# Altium schematic sheet MotorVSense.SchDoc
size A
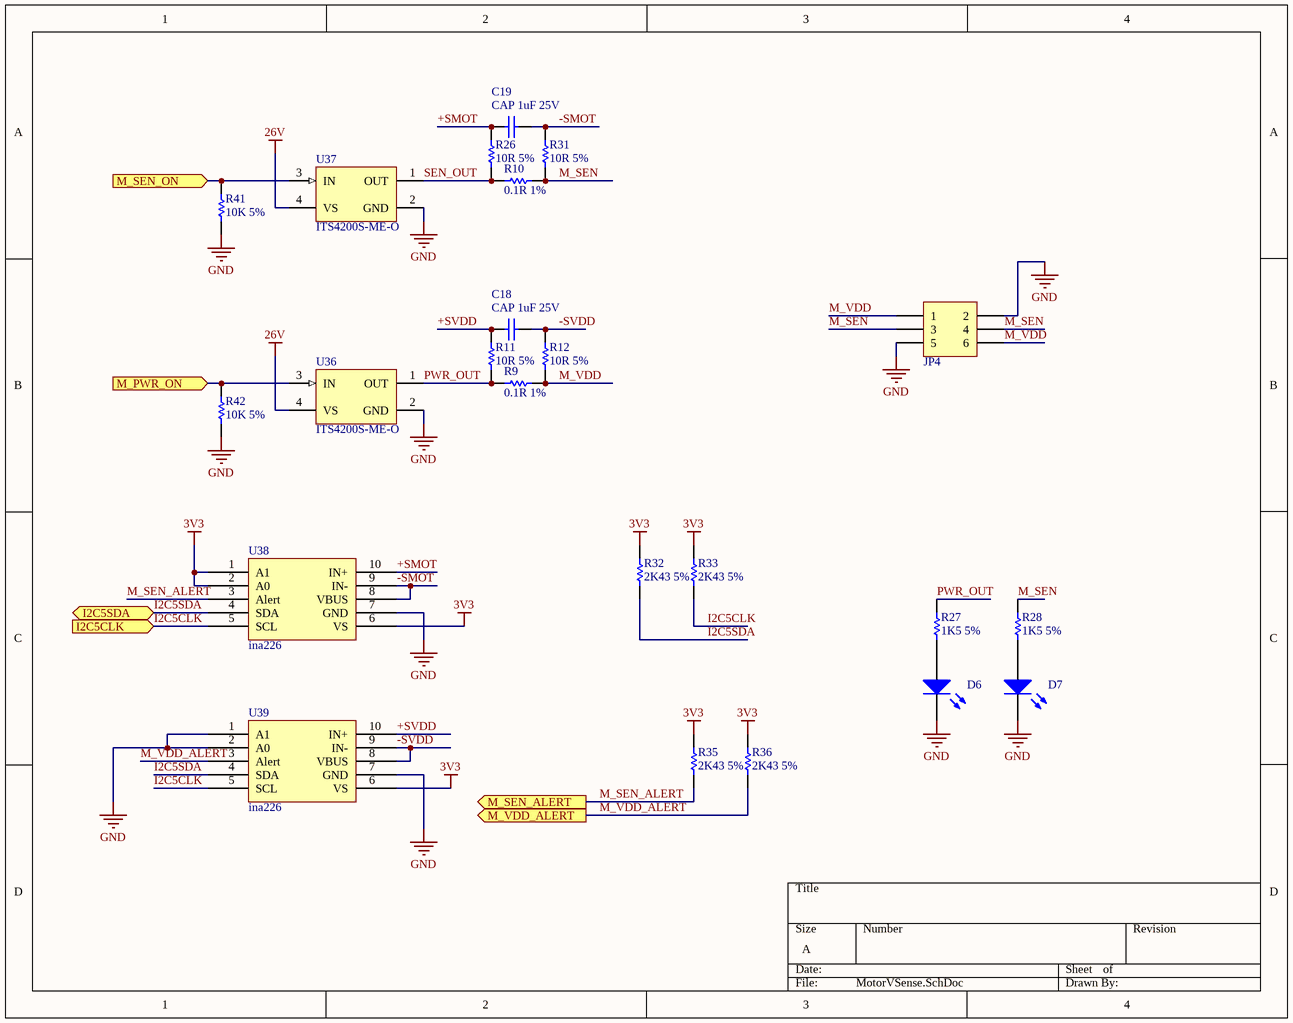
[diagram p0: MotorVSense.SchDoc]

## Parts
C18  CAP 1uF 25V  [CAPC0603(1608)100_M]
C19  CAP 1uF 25V  [CAPC0603(1608)100_M]
D6  LED  [LED-0603]  (value not drawn)
D7  LED  [LED-0603]  (value not drawn)
JP4  Header 3x2 2.54mm  [2X3]  (value not drawn)
R9  0.1R 1%  [RESC2010(5025)_M]
R10  0.1R 1%  [RESC2010(5025)_M]
R11  10R 5%  [RESC0603(1608)_M]
R12  10R 5%  [RESC0603(1608)_M]
R26  10R 5%  [RESC0603(1608)_M]
R27  1K5 5%  [RESC0603(1608)_M]
R28  1K5 5%  [RESC0603(1608)_M]
R31  10R 5%  [RESC0603(1608)_M]
R32  2K43 5%  [RESC0603(1608)_M]
R33  2K43 5%  [RESC0603(1608)_M]
R35  2K43 5%  [RESC0603(1608)_M]
R36  2K43 5%  [RESC0603(1608)_M]
R41  10K 5%  [RESC0603(1608)_N]
R42  10K 5%  [RESC0603(1608)_M]
U36  ITS4200S-ME-O  [INF-SOT223_M]
U37  ITS4200S-ME-O  [INF-SOT223_M]
U38  ina226  [SP10]
U39  ina226  [SP10]

## Ports
I2C5CLK (in), I2C5SDA (bidir), M_PWR_ON (in), M_SEN_ALERT (out), M_SEN_ON (in), M_VDD_ALERT (out)

## Nets
3V3: R32.2 R33.2 R35.2 R36.2 U38.1(A1) U38.2(A0) U38.6(VS) U39.6(VS)
26V: U36.4(VS) U37.4(VS)
GND: D6.2(K) D7.2(K) JP4.2 JP4.5 R41.1 R42.1 U36.2(GND) U37.2(GND) U38.7(GND) U39.1(A1) U39.2(A0) U39.7(GND)
+SMOT: C19.2 R26.2 U38.10(IN+)
+SVDD: C18.2 R11.2 U39.10(IN+)
-SMOT: C19.1 R31.2 U38.8(VBUS) U38.9(IN-)
-SVDD: C18.1 R12.2 U39.8(VBUS) U39.9(IN-)
I2C5CLK: R33.1 U38.5(SCL) U39.5(SCL) ; port I2C5CLK
I2C5SDA: R32.1 U38.4(SDA) U39.4(SDA) ; port I2C5SDA
M_PWR_ON: R42.2 U36.3(IN) ; port M_PWR_ON
M_SEN: JP4.3 JP4.4 R10.2 R28.2 R31.1
M_SEN_ALERT: R35.1 U38.3(Alert) ; port M_SEN_ALERT
M_SEN_ON: R41.2 U37.3(IN) ; port M_SEN_ON
M_VDD: JP4.1 JP4.6 R9.2 R12.1
M_VDD_ALERT: R36.1 U39.3(Alert) ; port M_VDD_ALERT
PWR_OUT: R9.1 R11.1 R27.2 U36.1(OUT)
SEN_OUT: R10.1 R26.1 U37.1(OUT)
NetD6_1: D6.1(A) R27.1
NetD7_1: D7.1(A) R28.1

## Library data of the parts
C18 C19 = CMP-1035-00037-1: CAP 1uF 25V Â±0.25pF 0603 (1608 Metric) Thickness 1mm SMD; Case-Metric: 1608; Case-EIA: 0603; Tolerance: Â±0.25pF; Max Thickness: 1 mm; Value: 1uF; Technology: SMT; Rated Voltage: 25 V
D6 D7 = LED: Typical RED, GREEN, YELLOW, AMBER GaAs LED; Published: 8-Jun-2000; LatestRevisionDate: 17-Jul-2002; LatestRevisionNote: Re-released for DXP Platform.; PackageVersion: Feb-2002; PackageReference: 3.2X1.6X1.1; Publisher: Altium Limited; PackageDescription: SM LED; 2 Flat Leads; Supplier 1: Digi-Key; Supplier 2: Mouser; Supplier Part Number 1: 475-1409-1-ND; Supplier Part Number 2: 720-LGQ971-KN-1
JP4 = Header 3x2: Header, 6-Pin; Supplier 1: Digi-Key; Supplier 2: Mouser; Supplier Part Number 1: 952-1788-ND; Supplier Part Number 2: 855-M20-9980446
R9 R10 = CMP-1017-00001-1: 0.1R 2010 1%; Case-Metric: 5025; Value: 0.10 Ohm; Case-EIA: 2010; Tolerance: None; Technology: SMT; Power: None
R11 R12 R26 R31 = CMP-1012-00026-1: 10R 0.1W 5% 0603 (1608 Metric)  SMD; Case-Metric: 1608; Case-EIA: 0603; Value: 10.00 Ohm; Technology: SMT; Tolerance: 5 %; Power: 0.1 W
R27 R28 = CMP-1012-00078-1: 1K5 0.1W 5% 0603 (1608 Metric)  SMD; Case-Metric: 1608; Case-EIA: 0603; Value: 1500.00 Ohm; Technology: SMT; Power: 0.1 W; Tolerance: 5 %
R32 R33 R35 R36 = CMP-1012-00083-1: 2K43 0.1W 5% 0603 (1608 Metric)  SMD; Value: 2430.00 Ohm; Case-Metric: 1608; Case-EIA: 0603; Tolerance: 5 %; Technology: SMT; Power: 0.1 W
R41 R42 = CMP-1012-00098-1: 10K 0.1W 5% 0603 (1608 Metric)  SMD; Case-EIA: 0603; Value: 10000.00 Ohm; Case-Metric: 1608; Technology: SMT; Tolerance: 5 %; Power: 0.1 W
U36 U37 = CMP-1095-00143-1: Smart High-Side NMOS-Power Switch, 11 to 45 V Operating, -40 to 125 degC, SOT223, Reel, Green; Manufacturer: Infineon; Channels: 1; IL (nom)min - one channel active: 0.7Â A; Green: TRUE; Operating Voltage Range (min): 11 V; RON (max) @ Tj max: 320 mOhm; Operating Voltage Range (max): 45 V; Ptot (max): 1.4Â W; toff (max): 150 us; RON @ 25 degC: 200 mOhm (max); IL (SCp): 1.4Â A; IL (SC): 1.1Â A; ton (max): 100 us; Packing: Reel; IL (nom)min - all channels active: 0.7Â A; ComponentLink2Description: Datasheet; Load Current (typ): 0.7Â A; ComponentLink1Description: Manufacturer URL; PackageDescription: 4-Pin Small Outline Transistor Package, 6.5 x 3.5 mm Body, 2.3 mm Pitch; Mounting Technology: Surface Mount; ComponentLink1URL: http://www.infineon.com/; ComponentLink2URL: http://www.infineon.com/dgdl/ITS4200S-ME-O_01092012S.pdf?folderId=db3a304412b407950112b408e8c90004&fileId=db3a304339dcf4b1013a013fb7455740; ComponentLink3URL: http://www.infineon.com/dgdl/SOT223-Package_Overview.pdf?folderId=db3a30431936bc4b0119530470b03c3d&fileId=db3a30431936bc4b0119531d40b93c5c; PackageReference: SOT223; ComponentLink3Description: Package Specification; PartNumber: ITS4200S-ME-O; DatasheetVersion: Rev. 1.0; PackageVersion: Apr-08
U38 U39 = ina226: Supplier 1: Digi-Key; Supplier Part Number 1: 296-29034-1-ND